# Altium schematic sheet Sheet1.SchDoc
size A4
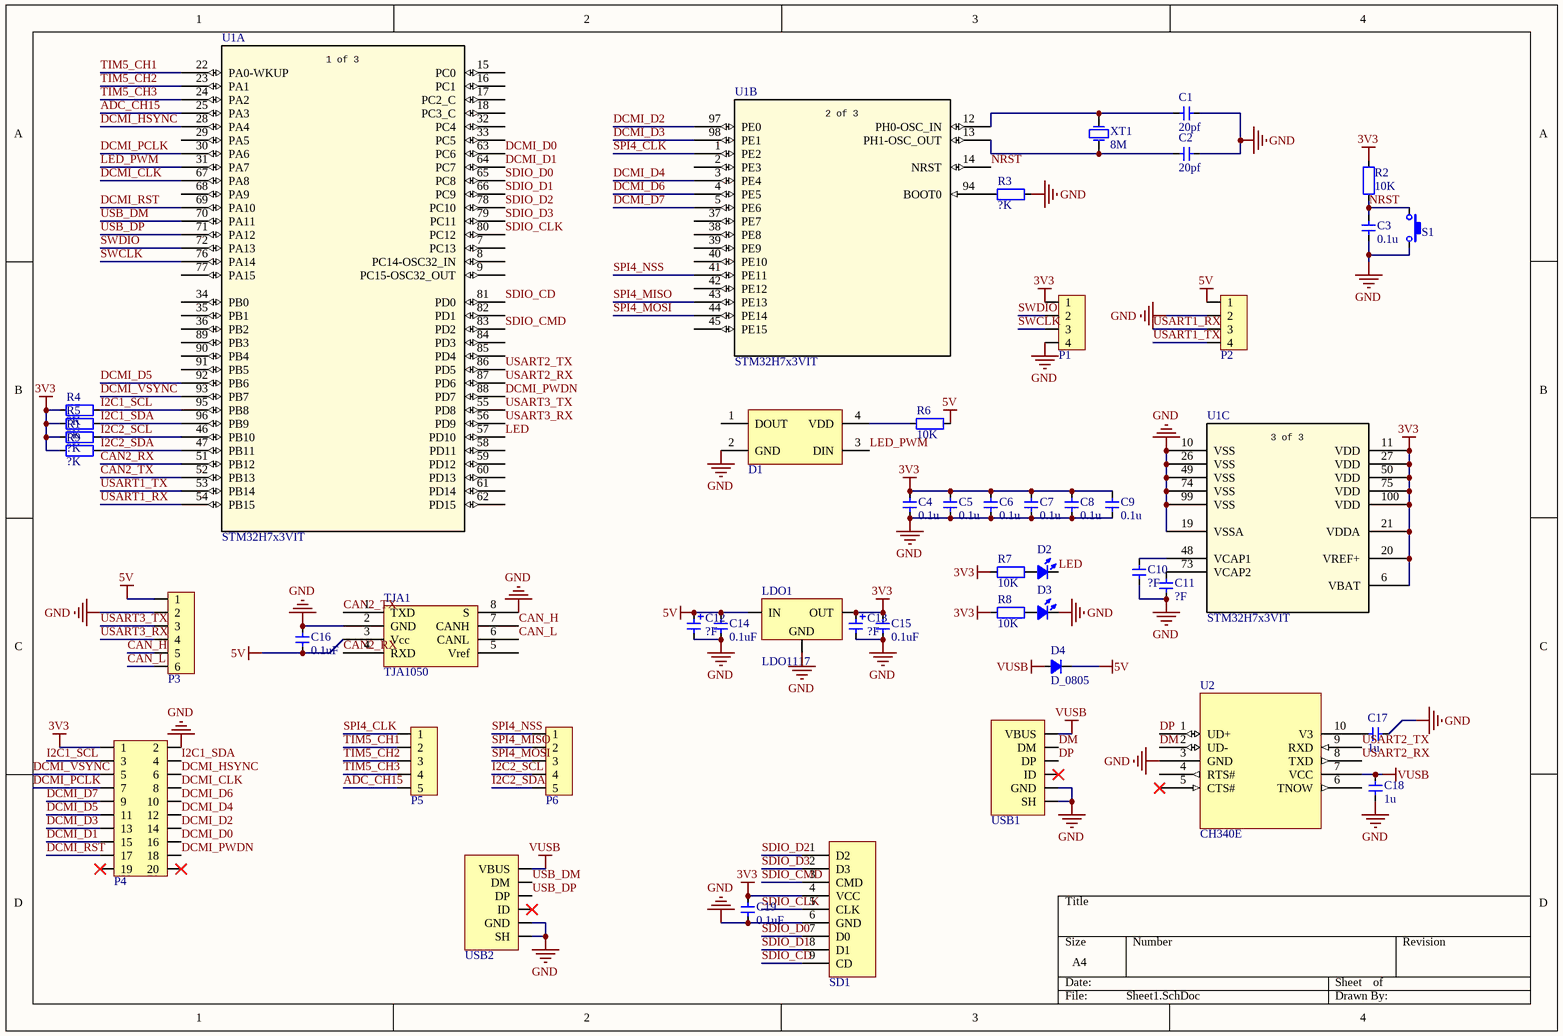
[diagram p0: Sheet1.SchDoc]

## Parts
C1  value 20pf  [CAP_0603]  (hidden comment: Cap_0603)
C2  value 20pf  [CAP_0603]  (hidden comment: Cap_0603)
C3  value 0.1u  [CAP_0603]  (hidden comment: Cap_0603)
C4  value 0.1u  [CAP_0603]  (hidden comment: Cap_0603)
C5  value 0.1u  [CAP_0603]  (hidden comment: Cap_0603)
C6  value 0.1u  [CAP_0603]  (hidden comment: Cap_0603)
C7  value 0.1u  [CAP_0603]  (hidden comment: Cap_0603)
C8  value 0.1u  [CAP_0603]  (hidden comment: Cap_0603)
C9  value 0.1u  [CAP_0603]  (hidden comment: Cap_0603)
C10  value ?F  [CAP_0603]  (hidden comment: Cap_0603)
C11  value ?F  [CAP_0603]  (hidden comment: Cap_0603)
C12  value ?F  [CAP_TAN_A1206]  (hidden comment: Cap_Tan_1206)
C13  value ?F  [CAP_TAN_A1206]  (hidden comment: Cap_Tan_1206)
C14  value 0.1uF  [CAP_0603]  (hidden comment: Cap_0603)
C15  value 0.1uF  [CAP_0603]  (hidden comment: Cap_0603)
C16  value 0.1uF  [CAP_0603]  (hidden comment: Cap_0603)
C17  value 1u  [CAP_0603]  (hidden comment: Cap_0603)
C18  value 1u  [CAP_0603]  (hidden comment: Cap_0603)
C19  value 0.1uF  [CAP_0603]  (hidden comment: Cap_0603)
D1  LED_3535_SK6812  [LED_3535_4P]  (value not drawn)
D2  LED_0805  [LED_0805_RED]  (value not drawn)
D3  LED_0805  [LED_0805_RED]  (value not drawn)
D4  D_0805  [LED_0805_YELLOW]
LDO1  LDO1117  [SOT223-3]
P1  HDR1x4_2.54  [HDR1x4_2.54_180]  (value not drawn)
P2  HDR1x4_2.54  [HDR1x4_2.54_180]  (value not drawn)
P3  HDR1x6_2.54  [HDR1X6_2.54_180]  (value not drawn)
P4  HDR2x10_2.54  [HDR2X10_2.54_180]  (value not drawn)
P5  HDR1x5_2.54  [HDR1X5_2.54_180]  (value not drawn)
P6  HDR1x5_2.54  [HDR1X5_2.54_180]  (value not drawn)
R1  value ?K  [RES_0603]  (hidden comment: Res_0603)
R2  value 10K  [RES_0603]  (hidden comment: Res_0603)
R3  value ?K  [RES_0603]  (hidden comment: Res_0603)
R4  value ?K  [RES_0603]  (hidden comment: Res_0603)
R5  value ?K  [RES_0603]  (hidden comment: Res_0603)
R6  value 10K  [RES_0603]  (hidden comment: Res_0603)
R7  value 10K  [RES_0603]  (hidden comment: Res_0603)
R8  value 10K  [RES_0603]  (hidden comment: Res_0603)
R9  value ?K  [RES_0603]  (hidden comment: Res_0603)
S1  ButtonTACT_3x4x2_180  [ButtonTACT_3x4x2_180H]  (value not drawn)
SD1  SD_Card_TF  [SD_Card_TF]  (value not drawn)
TJA1  TJA1050  [SOP_E150_8]
U1  STM32H7x3VIT  [STM32H743VIT]  (parts A,B,C of 3)
U2  CH340E  [MSOP10]
USB1  USB_Micro  [USB_Micro-AB]  (value not drawn)
USB2  USB_Micro  [USB_Micro-AB]  (value not drawn)
XT1  value 8M  [XT_5032_2]  (hidden comment: XTAL_5032_2P)

## Nets
3V3: C4.2 C5.2 C6.2 C7.2 C8.2 C9.2 C13.1 C15.2 C19.2 LDO1.2(OUT) P1.1 P4.1 R1.1 R2.1 R4.1 R5.1 R7.1 R8.1 R9.1 SD1.4(VCC) U1.6(VBAT) U1.11(VDD) U1.20(VREF+) U1.21(VDDA) U1.27(VDD) U1.50(VDD) U1.75(VDD) U1.100(VDD)
5V: C12.1 C14.2 C16.2 D4.2(K) LDO1.3(IN) P2.1 P3.1 R6.2 TJA1.3(Vcc)
GND: C1.1 C2.1 C3.1 C4.1 C5.1 C6.1 C7.1 C8.1 C9.1 C10.1 C11.1 C12.2 C13.2 C14.1 C15.1 C16.1 C17.1 C18.2 C19.1 D1.2(GND) D3.2(K) LDO1.1(GND) P1.4 P2.2 P3.2 P4.2 R3.2 S1.2 SD1.6(GND) TJA1.2(GND) TJA1.8(S) U1.10(VSS) U1.19(VSSA) U1.26(VSS) U1.49(VSS) U1.74(VSS) U1.99(VSS) U2.3(GND) USB1.0(SH) USB1.5(GND) USB2.0(SH) USB2.5(GND)
VUSB: C18.1 D4.1(A) U2.7(VCC) USB1.1(VBUS) USB2.1(VBUS)
ADC_CH15: P5.5 U1.25(PA3)
CAN2_RX: TJA1.4(RXD) U1.51(PB12)
CAN2_TX: TJA1.1(TXD) U1.52(PB13)
CAN_H: P3.5 TJA1.7(CANH)
CAN_L: P3.6 TJA1.6(CANL)
DCMI_CLK: P4.8 U1.67(PA8)
DCMI_D0: P4.16 U1.63(PC6)
DCMI_D1: P4.15 U1.64(PC7)
DCMI_D2: P4.14 U1.97(PE0)
DCMI_D3: P4.13 U1.98(PE1)
DCMI_D4: P4.12 U1.3(PE4)
DCMI_D5: P4.11 U1.92(PB6)
DCMI_D6: P4.10 U1.4(PE5)
DCMI_D7: P4.9 U1.5(PE6)
DCMI_HSYNC: P4.6 U1.28(PA4)
DCMI_PCLK: P4.7 U1.30(PA6)
DCMI_PWDN: P4.18 U1.88(PD7)
DCMI_RST: P4.17 U1.69(PA10)
DCMI_VSYNC: P4.5 U1.93(PB7)
DM: U2.2(UD-) USB1.2(DM)
DP: U2.1(UD+) USB1.3(DP)
I2C1_SCL: P4.3 R4.2 U1.95(PB8)
I2C1_SDA: P4.4 R5.2 U1.96(PB9)
I2C2_SCL: P6.4 R1.2 U1.46(PB10)
I2C2_SDA: P6.5 R9.2 U1.47(PB11)
LED: D2.2(K) U1.57(PD10)
LED_PWM: D1.3(DIN) U1.31(PA7)
NRST: C3.2 R2.2 S1.1 U1.14(NRST)
SDIO_CD: SD1.9(CD) U1.81(PD0)
SDIO_CLK: SD1.5(CLK) U1.80(PC12)
SDIO_CMD: SD1.3(CMD) U1.83(PD2)
SDIO_D0: SD1.7(D0) U1.65(PC8)
SDIO_D1: SD1.8(D1) U1.66(PC9)
SDIO_D2: SD1.1(D2) U1.78(PC10)
SDIO_D3: SD1.2(D3) U1.79(PC11)
SPI4_CLK: P5.1 U1.1(PE2)
SPI4_MISO: P6.2 U1.43(PE13)
SPI4_MOSI: P6.3 U1.44(PE14)
SPI4_NSS: P6.1 U1.41(PE11)
SWCLK: P1.3 U1.76(PA14)
SWDIO: P1.2 U1.72(PA13)
TIM5_CH1: P5.2 U1.22(PA0-WKUP)
TIM5_CH2: P5.3 U1.23(PA1)
TIM5_CH3: P5.4 U1.24(PA2)
USART1_RX: P2.3 U1.54(PB15)
USART1_TX: P2.4 U1.53(PB14)
USART2_RX: U1.87(PD6) U2.8(TXD)
USART2_TX: U1.86(PD5) U2.9(RXD)
USART3_RX: P3.4 U1.56(PD9)
USART3_TX: P3.3 U1.55(PD8)
USB_DM: U1.70(PA11) USB2.2(DM)
USB_DP: U1.71(PA12) USB2.3(DP)
NetC1_2: C1.2 U1.12(PH0-OSC_IN) XT1.2(OSC2)
NetC2_2: C2.2 U1.13(PH1-OSC_OUT) XT1.1(OSC1)
NetC10_2: C10.2 U1.48(VCAP1)
NetC11_2: C11.2 U1.73(VCAP2)
NetC17_2: C17.2 U2.10(V3)
NetD1_4: D1.4(VDD) R6.1
NetD2_1: D2.1(A) R7.2
NetD3_1: D3.1(A) R8.2
NetR3_1: R3.1 U1.94(BOOT0)

Not connected (* = marked no-connect by the designer): D1 1(DOUT); P4 19* 20*; TJA1 5(Vref); U1 2(PE3) 7(PC13) 8(PC14-OSC32_IN) 9(PC15-OSC32_OUT) 15(PC0) 16(PC1) 17(PC2_C) 18(PC3_C) 29(PA5) 32(PC4) 33(PC5) 34(PB0) 35(PB1) 36(PB2) 37(PE7) 38(PE8) 39(PE9) 40(PE10) 42(PE12) 45(PE15) 58(PD11) 59(PD12) 60(PD13) 61(PD14) 62(PD15) 68(PA9) 77(PA15) 82(PD1) 84(PD3) 85(PD4) 89(PB3) 90(PB4) 91(PB5); U2 4(RTS#) 5(CTS#)* 6(TNOW); USB1 4(ID)*; USB2 4(ID)*

## Notes on the sheet
- (in symbol STM32H7x3VIT, part A) 1 of 3
- (in symbol STM32H7x3VIT, part B) 2 of 3
- (in symbol STM32H7x3VIT, part C) 3 of 3

## Library data of the parts
C1-C11 C14-C19 = Cap_0603: Capacitor
C12 C13 = Cap_Tan_1206: Capacitor
D1 = LED_3535_SK6812: LED
D2 D3 = LED_0805: LED
LDO1 = LDO1117: Power
P1 P2 = HDR1x4_2.54: Header
P3 = HDR1x6_2.54: Header
P4 = HDR2x10_2.54: Header
P5 P6 = HDR1x5_2.54: Header
R1-R9 = Res_0603: Resistor
S1 = ButtonTACT_3x4x2_180: Button
SD1 = SD_Card_TF: SD
U1 = STM32H7x3VIT: Imported; Vendor: STMicroelectronics; Copyright: Copyright (C) 2016 Accelerated Designs. All rights reserved; Manufacturer_Part_Number: stm32h7x3vit; Value: Value; Type: Type; RefDes: RefDes
U2 = CH340E: USB to TTL Serial / UART
USB1 USB2 = USB_Micro: USB
XT1 = XTAL_5032_2P: Crystal Oscillator